# Altium schematic sheet ESD-ESP32.SchDoc
size A; SheetNumber: 3; SheetTotal: 6
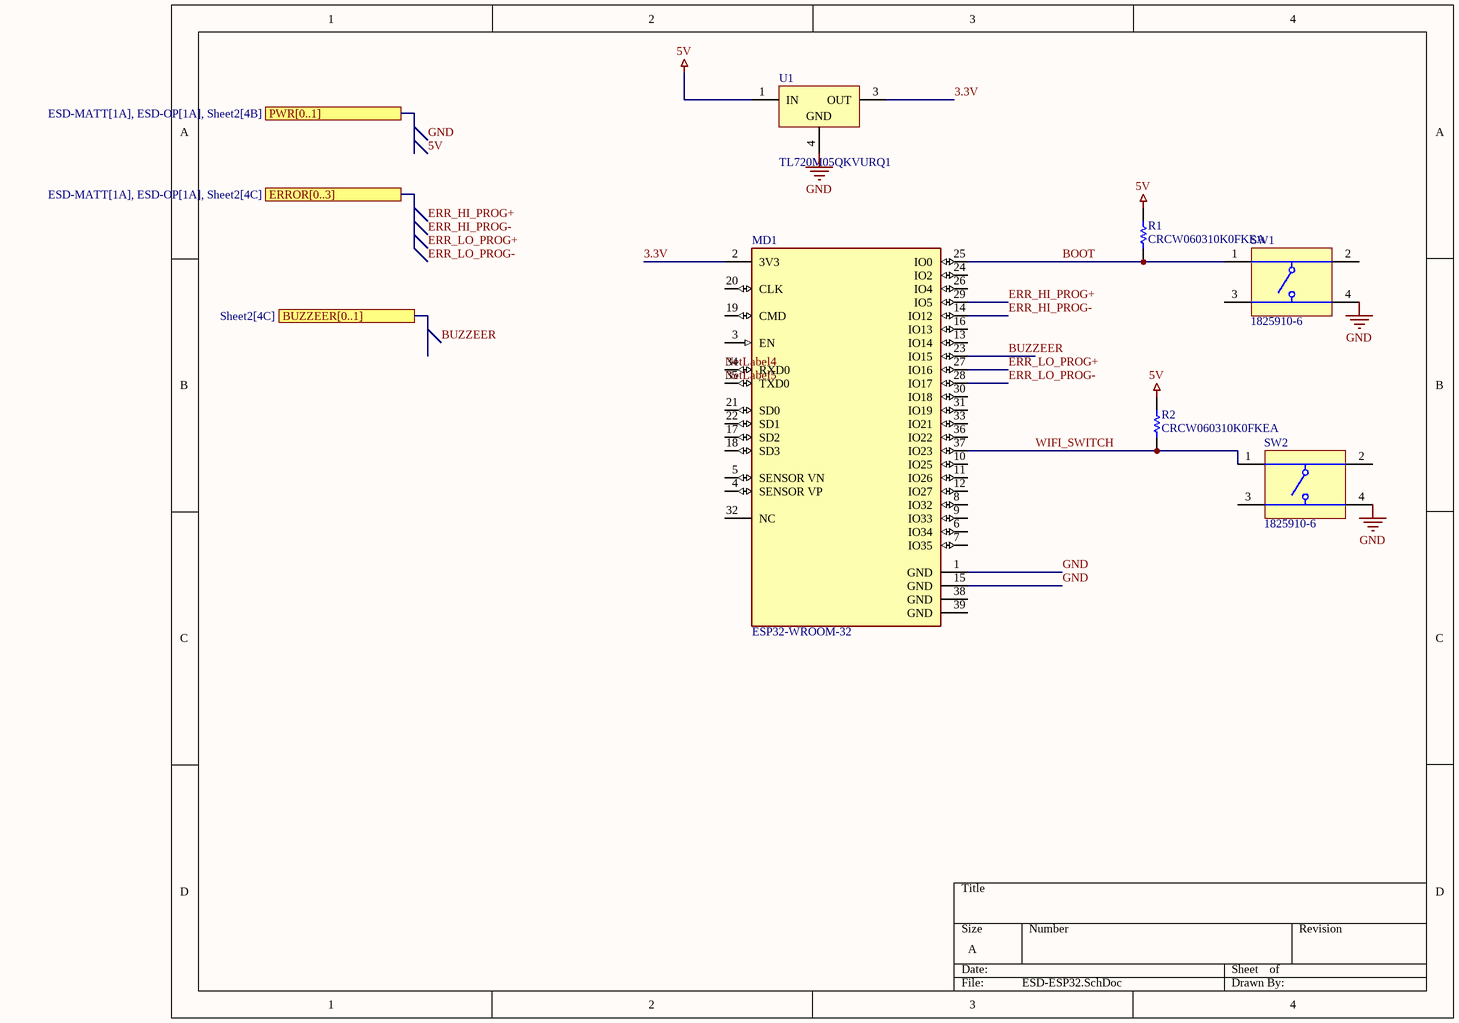
[diagram p0: ESD-ESP32.SchDoc]

## Parts
MD1  ESP32-WROOM-32  [FP-ESP32-WROOM-32-MFG]
R1  CRCW060310K0FKEA  [RESC1609X50X30NL8T20]
R2  CRCW060310K0FKEA  [RESC1609X50X30NL8T20]
SW1  1825910-6  [TECO-1825910-6_V]
SW2  1825910-6  [TECO-1825910-6_V]
U1  TL720M05QKVURQ1  [KVU0003A_M]

## Ports
BUZZEER[0..1] (see Sheet2[4C]), ERROR[0..3] (see ESD-MATT[1A], ESD-OP[1A], Sheet2[4C]), PWR[0..1] (see ESD-MATT[1A], ESD-OP[1A], Sheet2[4B])

## Nets
5V: R1.2 R2.2 U1.1(IN)
GND: MD1.1(GND) MD1.15(GND) SW1.4 SW2.4 U1.4(GND)
3.3V: MD1.2(3V3) U1.3(OUT)
BOOT: MD1.25(IO0) R1.1 SW1.1
BUZZEER: MD1.23(IO15)
ERR_HI_PROG+: MD1.29(IO5)
ERR_HI_PROG-: MD1.14(IO12)
ERR_LO_PROG+: MD1.27(IO16)
ERR_LO_PROG-: MD1.28(IO17)
NetLabel4: MD1.34(RXD0)
NetLabel5: MD1.35(TXD0)
WIFI_SWITCH: MD1.37(IO23) R2.1 SW2.1

Not connected (* = marked no-connect by the designer): MD1 3(EN) 4(SENSOR_VP) 5(SENSOR_VN) 6(IO34) 7(IO35) 8(IO32) 9(IO33) 10(IO25) 11(IO26) 12(IO27) 13(IO14) 16(IO13) 17(SD2) 18(SD3) 19(CMD) 20(CLK) 21(SD0) 22(SD1) 24(IO2) 26(IO4) 30(IO18) 31(IO19) 32(NC) 33(IO21) 36(IO22) 38(GND) 39(GND); SW1 2 3; SW2 2 3

## Notes on the sheet
- Labels drawn without touching a wire or pin: 5V, BUZZEER, ERR_HI_PROG+, ERR_HI_PROG-, ERR_LO_PROG+, ERR_LO_PROG-, GND

## Library data of the parts
MD1 = CMP-194065-000008-1: RX TXRX MOD WIFI SURFACE MOUNT; Frequency: 2.5GHz; Sensitivity: -98dBm; Operating Supply Voltage: 3.6V; Data Rate: 150Mbps; Weight: 0.088185oz; Package Quantity: 550; Min Operating Temperature: -40°C; Mount: Surface Mount; Max Operating Temperature: 85°C; Packaging: Cut Tape; Case/Package: SMD/SMT
R1 R2 = CMP-1666-00005-4: Chip Resistor, 10 KOhm, +/- 1%, 100 mW, -55 to 155 degC, 0603 (1608 Metric), RoHS, Tape and Reel; Manufacturer: Vishay Semiconductor; Voltage Rating: 75 V; Max Operating Temperature: 155 degC; PackageDescription: 2-Pin Surface Mount Device, Body 1.575 x 0.85 mm; ComponentLink1Description: Manufacturer URL; RoHSCompliant: true; PackageReference: 0603; REACH SVHC: Unknown; Length: 1.55 mm; DatasheetVersion: 06/2012; Packaging: Tape and Reel; Min Operating Temperature: -55 degC; Mounting Technology: Surface Mount; ComponentLink2URL: https://datasheet.ciiva.com/11809/0900766b80d98afc-11809037.pdf; Height: 0.45 mm; ComponentLink2Description: Datasheet; Package Quantity: 5000; ComponentLink1URL: http://www.vishay.com/
SW1 SW2 = CMP-1684-00021-1: Tact Switch, SPST-NO, 0.05 A, -35 to 85 degC, 4-Pin THD, RoHS, Bulk; Manufacturer: TE Connectivity; Maximum Contact Resistance: 100mOhm; Mechanical Life: 100000Cycles; Bushing Type: Unthreaded; Switch Configuration: OFF(ON); Maximum DC Voltage Rating: 24V; Contact Rating @ Voltage: 0.05A@24VDC; Actuator Color: Black; Body Orientation: Straight; Function: MomentaryContact; Illumination: N/R; Actuator Style: RoundButton; Actuator Material: PolybutyleneTerephthalate; Dielectric Strength: 500VAC; Pole Throw Configuration: SPST; Actuator Length: 1.4mm; Product Weight: N/A; Contact Material: CopperAlloy; Housing Material: N/A; Terminal Type: PCPins; Minimum Insulation Resistance: 100MOhm; Package Description: 4-Pin Through Hole Device, Body 5.99 x 5.99 mm, Pitch 6.5 mm; Part No: 1825910-6; Package Reference: THD; Base Material: N/A; Manufacturer URL: http://www.te.com; Contact Plating: Silver; RoHS: Yes; Datasheet Version: Rev. C9; Electrical Life: 100000Cycles; Maximum AC Voltage Rating: N/A; Thread Size: N/R; Operating Temperature: -35to85C; Mounting: ThroughHole; Dimension: 5.99x5mm; Datasheet URL: http://www.te.com/commerce/DocumentDelivery/DDEController?Action=showdoc&DocId=Customer+Drawing%7F1825910%7FC9%7Fpdf%7FEnglish%7FENG_CD_1825910_C9.pdf%7F1825910-6; Family: 1825910; Seal Location: N/A; Seal Description: N/A; Packaging: N/A
U1 = CMP-0395-01074-2: Single Output Automotive LDO, 700 mA, Fixed 5 V Output, 5.5 to 42 V Input, 3-pin PFM (KVU), -40 to 125 degC, Green (RoHS & no Sb/Br); Manufacturer: Texas Instruments; Vin(Max)(V): 42; Vout Adj(Min)(V): 5; Vin(Min)(V): 5.5; Iq(Typ)(mA): 12; SubFamily: Single Channel LDO; Accuracy(%): 3; Vdo(Typ)(mV): 250; Iout(Max)(A): 0.7; Mounting Technology: Surface Mount; ComponentLink1Description: Manufacturer URL; Code_JEDEC: TO-252; ComponentLink3URL: http://www.ti.com/litv/pdf/mpsf018c; Fixed Output Options(V): 5; ComponentLink2URL: http://www.ti.com/general/docs/lit/getliterature.tsp?genericPartNumber=TL720M05-Q1&fileType=pdf; ComponentLink2Description: Datasheet; ComponentLink3Description: Package Specification; PackageReference: KVU0003A; PackageVersion: 4205521-2/D; PartNumber: TL720M05QKVURQ1; PackageDescription: 3-Pin Plastic Flange Mount, Body 6.1 x 6.6 mm, Pitch 2.29 mm; DatasheetVersion: SGLS380D; Eco-Plan: Green (RoHS & no Sb/Br); ComponentLink1URL: http://www.ti.com/; Vout Adj(Max)(V): 5